# EAGLE design Zynthian_Single_Encoder (EAGLE 7.5.0)
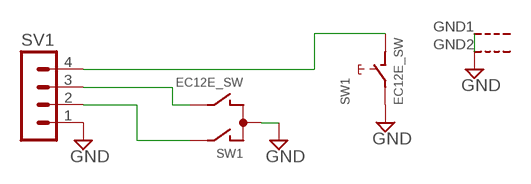
[diagram p0: schematic, sheet 1]

## Parts
SV1  MA04-1  [MA04-1]
SW1  EC12E_SW  [ALPS_EC12E_SW]

## Nets
GND: SV1.1 SW1.C SW1.E SW1.GND1(G) SW1.GND2(G)
N$1: SV1.2 SW1.A
N$2: SV1.3 SW1.B
N$3: SV1.4 SW1.D

## Library data of the parts
SV1 = con-lstb:MA04-1: PIN HEADER; OC_FARNELL: unknown; OC_NEWARK: unknown
SW1 = switch-alps:EC12E_SW: ALPS rotary Encoder EC12E series with switch; MPN: EC12E2424407; OC_FARNELL: 1520813; OC_NEWARK: 74M1068

## Board
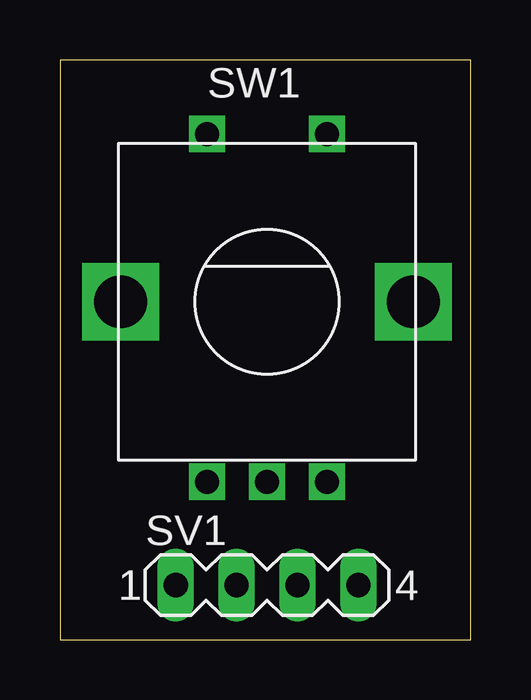
[diagram p1: board, top side]
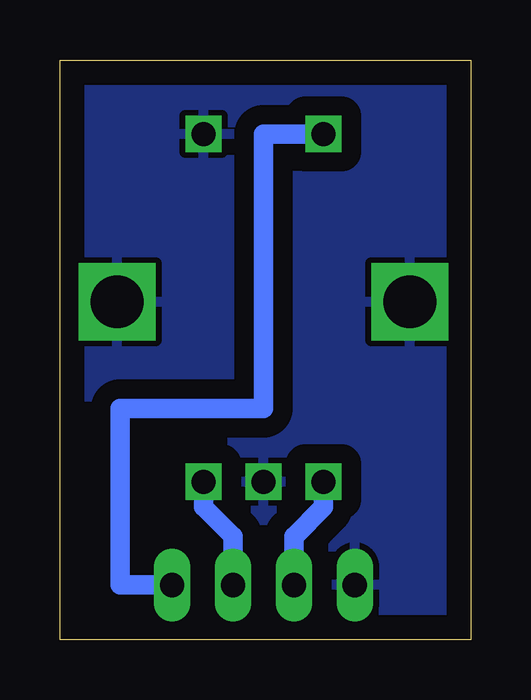
[diagram p2: board, bottom side, seen from below]

Size 17.12 x 24.18 mm. Coordinates in mm from the lower left corner, seen from the top.
Outline: 0,0 17.12,0 17.12,24.18 0,24.18 0,0
Copper layers (1*16): Top 0.035mm / dielectric 1.5mm / Bottom 0.035mm
Design rules "default": minimum track width 10mil, minimum drill 24mil, track to track 8mil, track to pad 8mil, pad to pad 8mil, via to via 8mil, smd to smd 8mil, copper to edge 40mil, drill to drill 8mil, minimum pad ring 10mil, minimum via ring 8mil, stop-mask expansion 4mil, vias tented up to drill 0mil, thermal gap 10mil

### Footprints (pad centres in the part's own frame; a part is rotated, then mirrored left to right if it is on the bottom)
MA04-1 = drill 1.016 long: 1 -3.81,0; 2 -1.27,0; 3 1.27,0; 4 3.81,0
ALPS_EC12E_SW = drill 1 square: A -2.5,-7.5; B 2.5,-7.5; C 0,-7.5; D -2.5,7; E 2.5,7 | drill 2.2 square: GND1 -6.1,0; GND2 6.1,0

### Placement (x,y rotation side)
SV1  8.64,2.29 0 top
SW1  8.64,14.1 0 top

### Tracks (layer width: path | path; a pad name or v marks a point on that pad's centre or on a via)
GND
  pour Bottom (isolate 0.813): -1.27,25.15 18.41,25.15 18.54,-1.27 -1.14,-1.27
N$1
  Bottom 0.813: SV1.2 7.37,4.32 7.35,4.32 6.14,5.54 SW1.A
N$2
  Bottom 0.813: SV1.3 9.91,4.32 11.14,5.55 SW1.B
N$3
  Bottom 0.813: SW1.D 8.64,21.1 8.64,9.65 14.61,9.65 14.61,2.29 SV1.4